# EAGLE design BBB_cape (EAGLE 9.6.2)
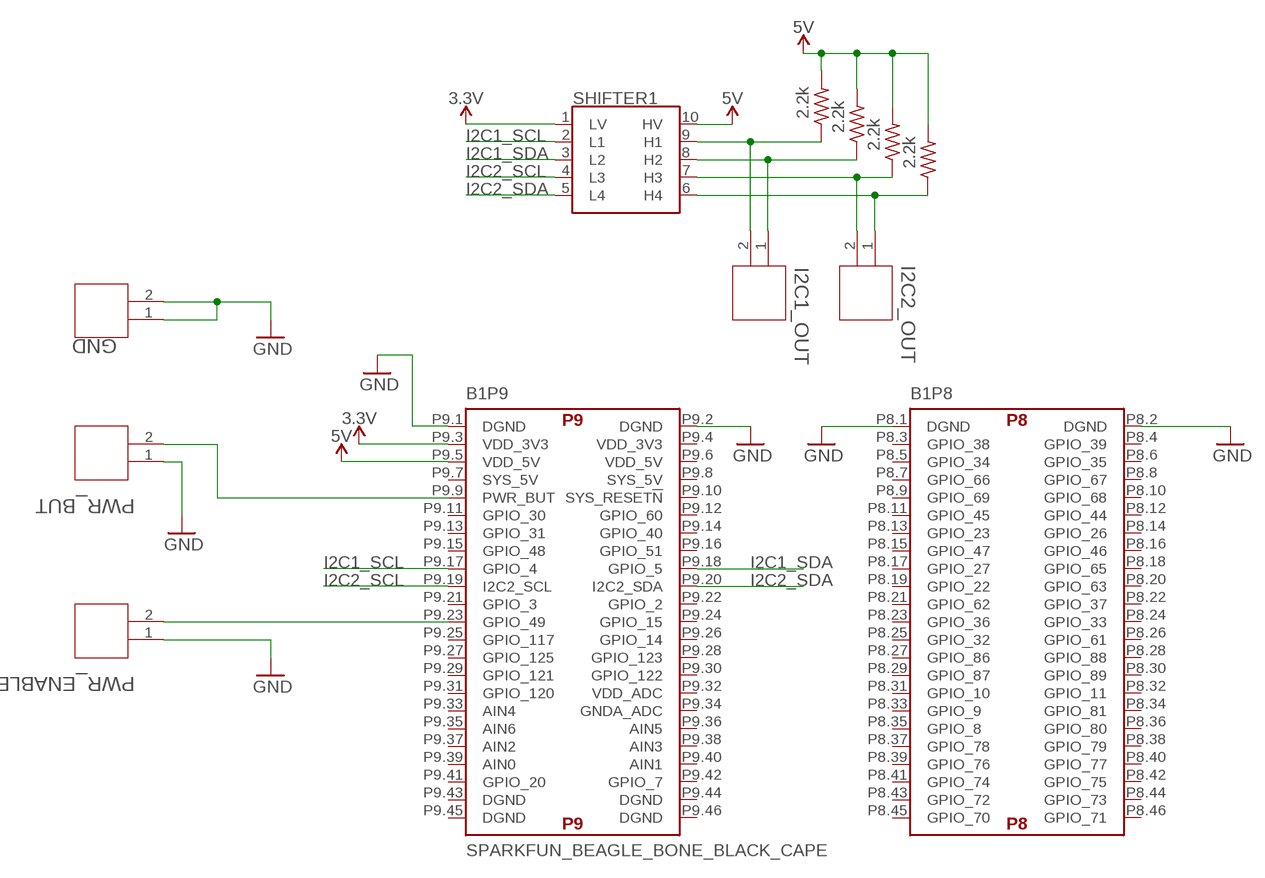
[diagram p0: schematic, sheet 1]

## Parts
B1  SPARKFUN_BEAGLE_BONE_BLACK_CAPE  [BEAGLE_BONE_BLACK_CAPE]
GND  PHOENIX_CONTACT_1758018  [PHOENIX_CONTACT_1758018]
I2C1_OUT  PHOENIX_CONTACT_1758018  [PHOENIX_CONTACT_1758018]
I2C2_OUT  PHOENIX_CONTACT_1758018  [PHOENIX_CONTACT_1758018]
PWR_BUT  PHOENIX_CONTACT_1758018  [PHOENIX_CONTACT_1758018]
PWR_ENABLE  PHOENIX_CONTACT_1758018  [PHOENIX_CONTACT_1758018]
R1  2.2k  R-US_0204/7  [0204/7]
R2  2.2k  R-US_0204/7  [0204/7]
R3  2.2k  R-US_0204/7  [0204/7]
R4  2.2k  R-US_0204/7  [0204/7]
SHIFTER1  POLOLU_LOGIC_SHIFTERPOLOLU  [POLOLU_LOGIC_SHIFTER]

## Nets
3.3V: B1.P9.3(P9:VDD_3V3) SHIFTER1.1(LV)
5V: B1.P9.5(P9:VDD_5V) R1.2 R2.2 R3.2 R4.2 SHIFTER1.10(HV)
GND: B1.P8.1(P8:DGND) B1.P8.2(P8:DGND) B1.P9.1(P9:DGND) B1.P9.2(P9:DGND) GND.1 GND.2 PWR_BUT.1 PWR_ENABLE.1
I2C1_SCL: B1.P9.17(P9:GPIO_4) SHIFTER1.2(L1)
I2C1_SDA: B1.P9.18(P9:GPIO_5) SHIFTER1.3(L2)
I2C2_SCL: B1.P9.19(P9:I2C2_SCL) SHIFTER1.4(L3)
I2C2_SDA: B1.P9.20(P9:I2C2_SDA) SHIFTER1.5(L4)
N$1: I2C1_OUT.2 R1.1 SHIFTER1.9(H1)
N$2: I2C1_OUT.1 R2.1 SHIFTER1.8(H2)
N$3: I2C2_OUT.2 R3.1 SHIFTER1.7(H3)
N$4: I2C2_OUT.1 R4.1 SHIFTER1.6(H4)
N$5: B1.P9.23(P9:GPIO_49) PWR_ENABLE.2
N$6: B1.P9.9(P9:PWR_BUT) PWR_BUT.2
Unconnected: B1.P8.3(P8:GPIO_38) B1.P8.4(P8:GPIO_39) B1.P8.5(P8:GPIO_34) B1.P8.6(P8:GPIO_35) B1.P8.7(P8:GPIO_66) B1.P8.8(P8:GPIO_67) B1.P8.9(P8:GPIO_69) B1.P8.10(P8:GPIO_68) B1.P8.11(P8:GPIO_45) B1.P8.12(P8:GPIO_44) B1.P8.13(P8:GPIO_23) B1.P8.14(P8:GPIO_26) B1.P8.15(P8:GPIO_47) B1.P8.16(P8:GPIO_46) B1.P8.17(P8:GPIO_27) B1.P8.18(P8:GPIO_65) B1.P8.19(P8:GPIO_22) B1.P8.20(P8:GPIO_63) B1.P8.21(P8:GPIO_62) B1.P8.22(P8:GPIO_37) B1.P8.23(P8:GPIO_36) B1.P8.24(P8:GPIO_33) B1.P8.25(P8:GPIO_32) B1.P8.26(P8:GPIO_61) B1.P8.27(P8:GPIO_86) B1.P8.28(P8:GPIO_88) B1.P8.29(P8:GPIO_87) B1.P8.30(P8:GPIO_89) B1.P8.31(P8:GPIO_10) B1.P8.32(P8:GPIO_11) B1.P8.33(P8:GPIO_9) B1.P8.34(P8:GPIO_81) B1.P8.35(P8:GPIO_8) B1.P8.36(P8:GPIO_80) B1.P8.37(P8:GPIO_78) B1.P8.38(P8:GPIO_79) B1.P8.39(P8:GPIO_76) B1.P8.40(P8:GPIO_77) B1.P8.41(P8:GPIO_74) B1.P8.42(P8:GPIO_75) B1.P8.43(P8:GPIO_72) B1.P8.44(P8:GPIO_73) B1.P8.45(P8:GPIO_70) B1.P8.46(P8:GPIO_71) B1.P9.4(P9:VDD_3V3) B1.P9.6(P9:VDD_5V) B1.P9.7(P9:SYS_5V) B1.P9.8(P9:SYS_5V) B1.P9.10(P9:SYS_RESET!N) B1.P9.11(P9:GPIO_30) B1.P9.12(P9:GPIO_60) B1.P9.13(P9:GPIO_31) B1.P9.14(P9:GPIO_40) B1.P9.15(P9:GPIO_48) B1.P9.16(P9:GPIO_51) B1.P9.21(P9:GPIO_3) B1.P9.22(P9:GPIO_2) B1.P9.24(P9:GPIO_15) B1.P9.25(P9:GPIO_117) B1.P9.26(P9:GPIO_14) B1.P9.27(P9:GPIO_125) B1.P9.28(P9:GPIO_123) B1.P9.29(P9:GPIO_121) B1.P9.30(P9:GPIO_122) B1.P9.31(P9:GPIO_120) B1.P9.32(P9:VDD_ADC) B1.P9.33(P9:AIN4) B1.P9.34(P9:GNDA_ADC) B1.P9.35(P9:AIN6) B1.P9.36(P9:AIN5) B1.P9.37(P9:AIN2) B1.P9.38(P9:AIN3) B1.P9.39(P9:AIN0) B1.P9.40(P9:AIN1) B1.P9.41(P9:GPIO_20) B1.P9.42(P9:GPIO_7) B1.P9.43(P9:DGND) B1.P9.44(P9:DGND) B1.P9.45(P9:DGND) B1.P9.46(P9:DGND)

## Library data of the parts
B1 = SparkFun-Boards:SPARKFUN_BEAGLE_BONE_BLACK_CAPE: BeagleBone Black Rev C Cape Generic footprint for BeagleBone Black Rev C Capes. SparkFun Products: SparkFun BeagleBone Black Proto Cape <https://www.sparkfun.com/products/12774> SparkFun CryptoCape <https://www.sparkfun.com/products/12773>
GND I2C1_OUT I2C2_OUT PWR_BUT PWR_ENABLE = byu_pressure_control:PHOENIX_CONTACT_1758018; ARTICLE_DESCRIPTION: MSTBV 2,5/ 2-G-5,08; BUILT_BY: EMA_Anthony; CONTACT_TYPE: male connector; COPYRIGHT: Copyright (C) 2018 Accelerated Designs. All rights reserved; MANUFACTURER_PART_NUMBER: 1758018; NUMBER_OF_CONNECTION: 2; NUMBER_OF_POSITION_PER_ROW: 2; NUMBER_OF_POTENTIALS: 2; NUMBER_OF_ROWS: 1; NUMBER_OF_SOLDER_PINS_PER_POTENTIALS: 1; PITCH__MM_: 5.08; PLUG_SYSTEM: CLASSIC COMBICON; PRODUCTTYP: PCB headers; PRODUCT_FAMILY: MSTBV 2,5/..-G; SOLDER_PIN_LENGTH__MM_: 3.9; SOURCELIBRARY: Phoenix_Contact_2020-08-21; VENDOR: Phoenix Contact
R1-R4 = rcl:R-US_: RESISTOR, American symbol; SPICEPREFIX: R
SHIFTER1 = byu_pressure_control:POLOLU_LOGIC_SHIFTER: Logic Level Shifter, 4-Channel, Bidirectional Pololu Link <https://www.pololu.com/product/2595> This tiny logic level shifter features four bi-directional channels, allowing for safe and easy communication between devices operating at different logic levels. It can convert signals as low as 1.5 V to as high as 18 V and vice versa, and its four channels are enough to support most common bidirectional and unidirectional digital interfaces, including I²C, SPI, and asynchronous TTL serial.

## Board
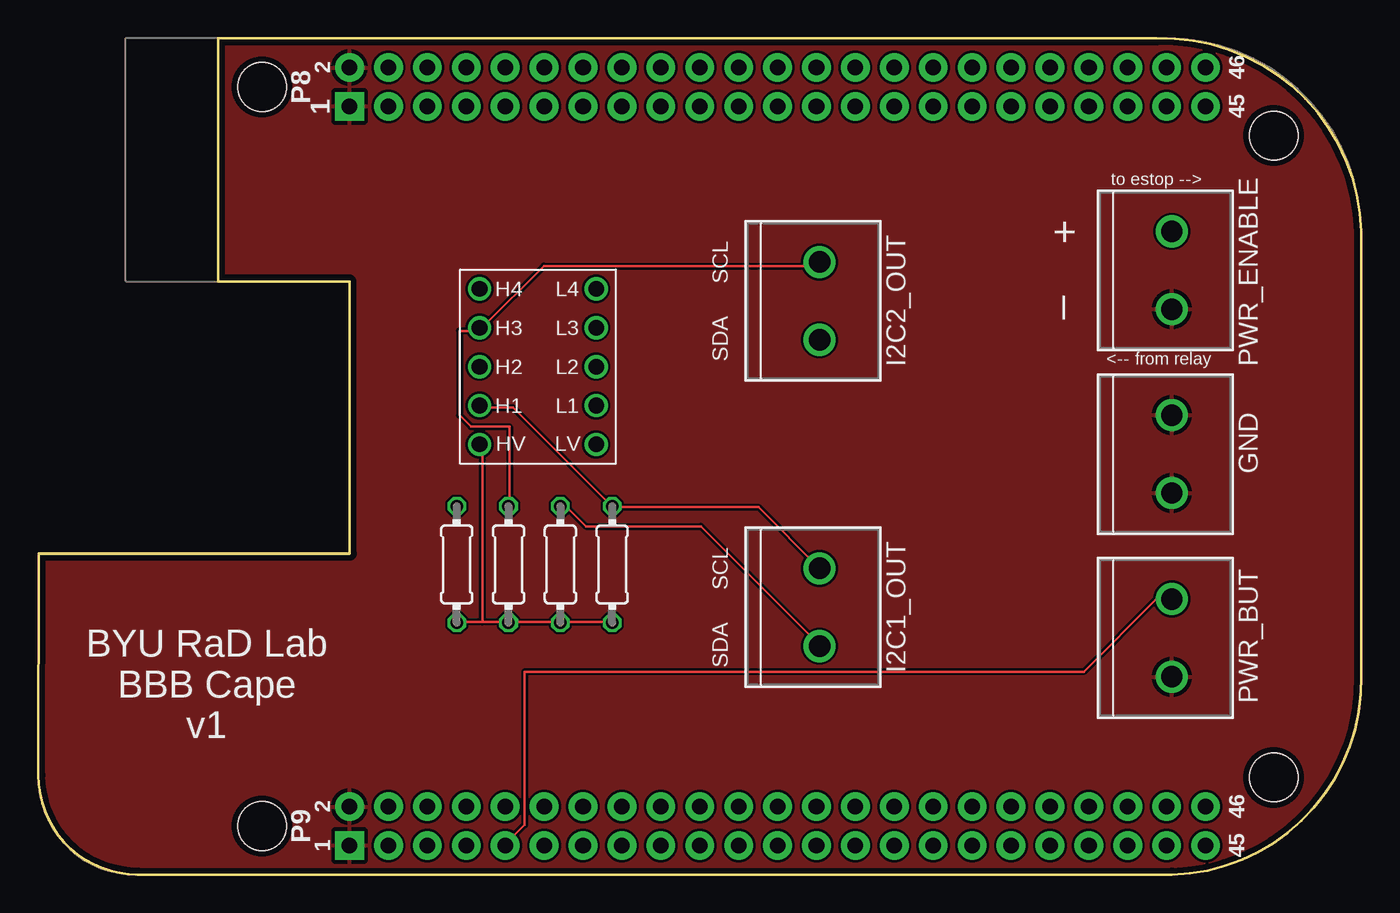
[diagram p1: board, top side]
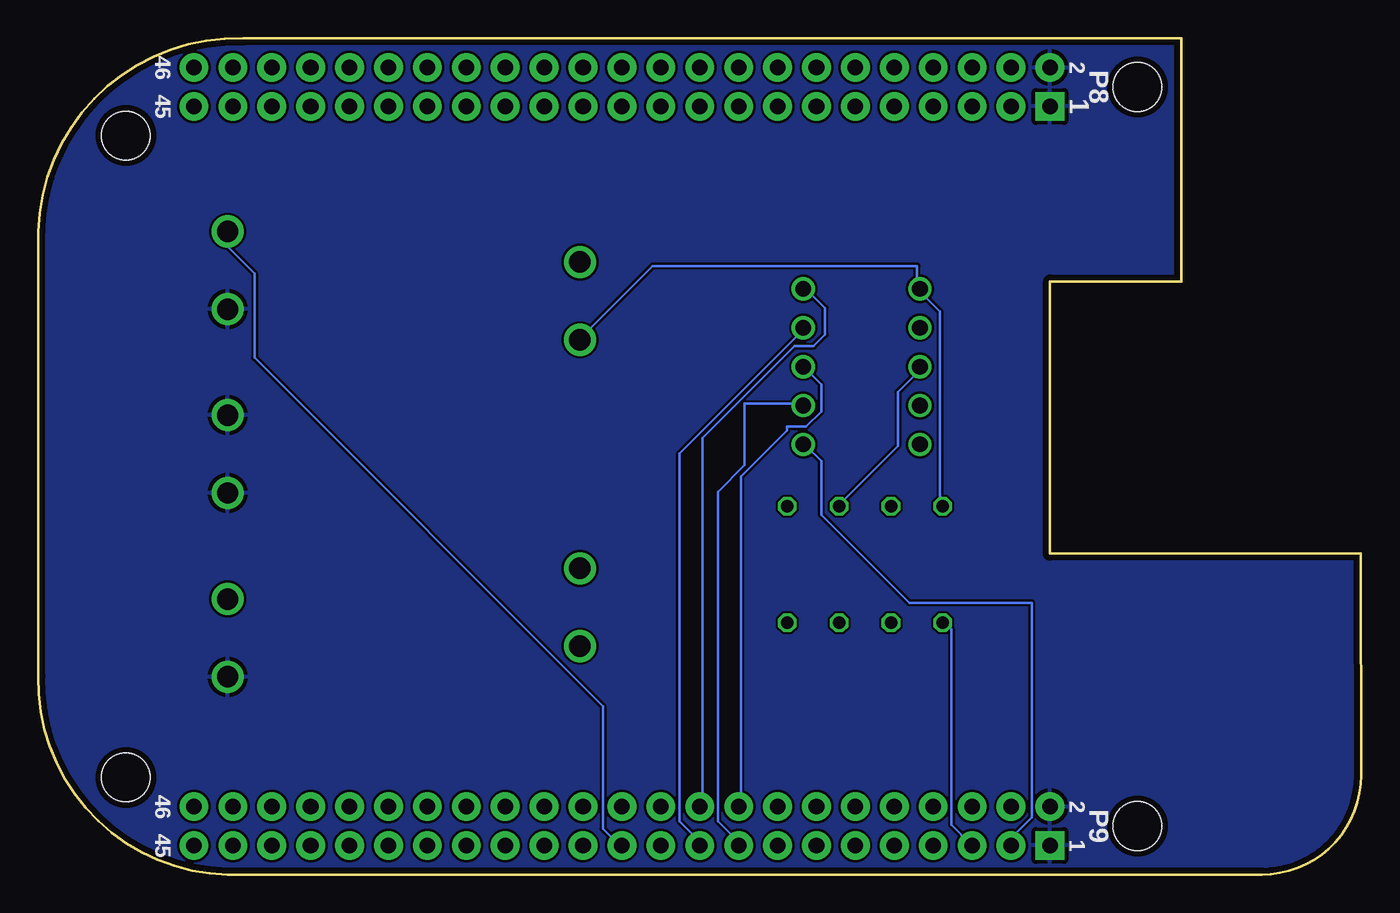
[diagram p2: board, bottom side, seen from below]

Size 86.36 x 54.61 mm. Coordinates in mm from the lower left corner, seen from the top.
Outline: 6.5,0 arc-90 0,6.5 0.01,20.96 20.33,20.96 20.32,38.73 11.74,38.73 11.74,54.61 73,54.61 arc-90 86.36,42 86.36,12.96 arc-90 74,0 6.5,0
Copper layers (1*16): Top 0.035559375mm / dielectric 1.6mm / Bottom 0.035559375mm
Design rules "oshpark-2layer": minimum track width 6mil, minimum drill 10mil, track to track 6mil, track to pad 6mil, pad to pad 6mil, via to via 6mil, smd to smd 6mil, copper to edge 15mil, drill to drill 6mil, minimum pad ring 5mil, minimum via ring 5mil, stop-mask expansion 2.5mil, vias tented up to drill 0mil, thermal gap 10mil
vRestrict: area -22.6,5 to -18.2,9.4

### Footprints (pad centres in the part's own frame; a part is rotated, then mirrored left to right if it is on the bottom)
BEAGLE_BONE_BLACK_CAPE = drill 1.016 pad 1.88 square: P8.1 -24.13,20.955; P9.1 -24.13,-27.305 | drill 1.016 pad 1.88: P8.2 -24.13,23.495; P8.3 -21.59,20.955; P8.4 -21.59,23.495; P8.5 -19.05,20.955; P8.6 -19.05,23.495; P8.7 -16.51,20.955; P8.8 -16.51,23.495; P8.9 -13.97,20.955; P8.10 -13.97,23.495; P8.11 -11.43,20.955; P8.12 -11.43,23.495; P8.13 -8.89,20.955; P8.14 -8.89,23.495; P8.15 -6.35,20.955; P8.16 -6.35,23.495; P8.17 -3.81,20.955; P8.18 -3.81,23.495; P8.19 -1.27,20.955; P8.20 -1.27,23.495; P8.21 1.27,20.955; P8.22 1.27,23.495; P8.23 3.81,20.955; P8.24 3.81,23.495; P8.25 6.35,20.955; P8.26 6.35,23.495; P8.27 8.89,20.955; P8.28 8.89,23.495; P8.29 11.43,20.955; P8.30 11.43,23.495; P8.31 13.97,20.955; P8.32 13.97,23.495; P8.33 16.51,20.955; P8.34 16.51,23.495; P8.35 19.05,20.955; P8.36 19.05,23.495; P8.37 21.59,20.955; P8.38 21.59,23.495; P8.39 24.13,20.955; P8.40 24.13,23.495; P8.41 26.67,20.955; P8.42 26.67,23.495; P8.43 29.21,20.955; P8.44 29.21,23.495; P8.45 31.75,20.955; P8.46 31.75,23.495; P9.2 -24.13,-24.765; P9.3 -21.59,-27.305; P9.4 -21.59,-24.765; P9.5 -19.05,-27.305; P9.6 -19.05,-24.765; P9.7 -16.51,-27.305; P9.8 -16.51,-24.765; P9.9 -13.97,-27.305; P9.10 -13.97,-24.765; P9.11 -11.43,-27.305; P9.12 -11.43,-24.765; P9.13 -8.89,-27.305; P9.14 -8.89,-24.765; P9.15 -6.35,-27.305; P9.16 -6.35,-24.765; P9.17 -3.81,-27.305; P9.18 -3.81,-24.765; P9.19 -1.27,-27.305; P9.20 -1.27,-24.765; P9.21 1.27,-27.305; P9.22 1.27,-24.765; P9.23 3.81,-27.305; P9.24 3.81,-24.765; P9.25 6.35,-27.305; P9.26 6.35,-24.765; P9.27 8.89,-27.305; P9.28 8.89,-24.765; P9.29 11.43,-27.305; P9.30 11.43,-24.765; P9.31 13.97,-27.305; P9.32 13.97,-24.765; P9.33 16.51,-27.305; P9.34 16.51,-24.765; P9.35 19.05,-27.305; P9.36 19.05,-24.765; P9.37 21.59,-27.305; P9.38 21.59,-24.765; P9.39 24.13,-27.305; P9.40 24.13,-24.765; P9.41 26.67,-27.305; P9.42 26.67,-24.765; P9.43 29.21,-27.305; P9.44 29.21,-24.765; P9.45 31.75,-27.305; P9.46 31.75,-24.765 | hole 3.175: -29.845,-26.035; 36.195,-22.86; 36.195,19.05; -29.845,22.225
PHOENIX_CONTACT_1758018 = drill 1.397 pad 1.905: 1 -5.08,0; 2 0,0
0204/7 = drill 0.813 octagon: 1 -3.81,0; 2 3.81,0
POLOLU_LOGIC_SHIFTER = drill 1.016: 1 1.27,11.43; 2 1.27,8.89; 3 1.27,6.35; 4 1.27,3.81; 5 1.27,1.27; 6 8.89,1.27; 7 8.89,3.81; 8 8.89,6.35; 9 8.89,8.89; 10 8.89,11.43

### Placement (x,y rotation side)
B1  44.45,29.21 0 top
GND  74,30 90 top
I2C1_OUT  51,20 90 top
I2C2_OUT  51,40 90 top
PWR_BUT  74,18 90 top
PWR_ENABLE  74,42 90 top
R1  37.46,20.26 270 top
R2  34.08,20.26 270 top
R3  30.7,20.26 270 top
R4  27.31,20.26 270 top
SHIFTER1  37.7,39.52 180 top

### Tracks (layer width: path | path; a pad name or v marks a point on that pad's centre or on a via)
3.3V
  Bottom 0.152: SHIFTER1.1 36.25,28 35.25,27 35.25,23.5 29.5,17.75 21.5,17.75 21.5,3.75 22.75,2.5 22.75,2 B1.P9.3
5V
  Top 0.152: 29,16.5 30.5,16.5 R3.2 30.75,16.5 34,16.5 R2.2 34.25,16.5 37.25,16.5 R1.2 | 29,16.5 27.5,16.5 R4.2 | 29,16.5 29,28 SHIFTER1.10
  Bottom 0.152: B1.P9.5 25.5,2 26.75,3.25 26.75,16 27.25,16.5 R4.2
GND
  pour Bottom: 6.5,0 arc-90 0,6.5 0.01,20.96 20.33,20.96 20.32,38.73 11.74,38.73 11.74,54.61 73,54.61 arc-90 86.36,42 86.36,12.96 arc-90 74,0
  pour Top: 6.5,0 arc-90 0,6.5 0.01,20.96 20.33,20.96 20.32,38.73 11.74,38.73 11.74,54.61 73,54.61 arc-90 86.36,42 86.36,12.96 arc-90 74,0
I2C1_SCL
  Bottom 0.152: SHIFTER1.2 36.5,30.75 40.25,30.75 40.25,26.75 42,25 42,3.5 40.75,2.25 40.75,2 B1.P9.17
I2C1_SDA
  Bottom 0.152: SHIFTER1.3 36.25,33 35.25,32 35.25,30.25 36.25,29.25 37.5,29.25 37.5,29 40.5,26 40.5,4.5 B1.P9.18
I2C2_SCL
  Bottom 0.152: SHIFTER1.4 36.5,35.5 44.5,27.5 44.5,3.5 43.25,2.25 43.25,2 B1.P9.19
I2C2_SDA
  Bottom 0.152: SHIFTER1.5 36.25,38.25 35,37 35,35.25 35.75,34.5 37,34.5 43,28.5 43,4.5 B1.P9.20
N$1
  Top 0.152: SHIFTER1.9 29,30.5 31,30.5 37.25,24.25 R1.1 37.5,24 47,24 I2C1_OUT.2
N$2
  Top 0.152: I2C1_OUT.1 51,15 43.25,22.75 35.75,22.75 34.5,24 34.25,24 R2.1
  Bottom 0.152: R2.1 34,24.25 30.25,28 30.25,31.5 29,32.75 29,33 SHIFTER1.8
N$3
  Top 0.152: R3.1 30.75,24.25 30.75,29.25 28.25,29.25 27.5,30 27.5,35.5 28.75,35.5 SHIFTER1.7 29,35.75 33,39.75 50.75,39.75 I2C2_OUT.2
N$4
  Bottom 0.152: R4.1 27.5,24.25 27.5,36.75 28.75,38 28.75,38.25 SHIFTER1.6 29,38.25 29,39.75 46.25,39.75 51,35 I2C2_OUT.1
N$5
  Bottom 0.152: PWR_ENABLE.2 74,41 72.25,39.25 72.25,33.75 49.5,11 49.5,3 48.5,2 B1.P9.23
N$6
  Top 0.152: PWR_BUT.2 73,18 68.25,13.25 31.75,13.25 31.75,3.25 30.5,2 B1.P9.9

### Text on the board
tPlace: to estop --> | + | SCL | _ | SDA | <-- from relay | SCL | BYU RaD Lab / BBB Cape / v1 | SDA